# Altium schematic sheet Power Distribution - Camera.SchDoc: Title
size B; Organization: Midnight Sun Solar Rayce Car Team; Address1: University of Waterloo; Address2: 200 University Ave W; Address3: Waterloo, ON, Canada; Address4: N2L 3E9; Website: www.uwmidsun.com; ProjectName: ProjectName
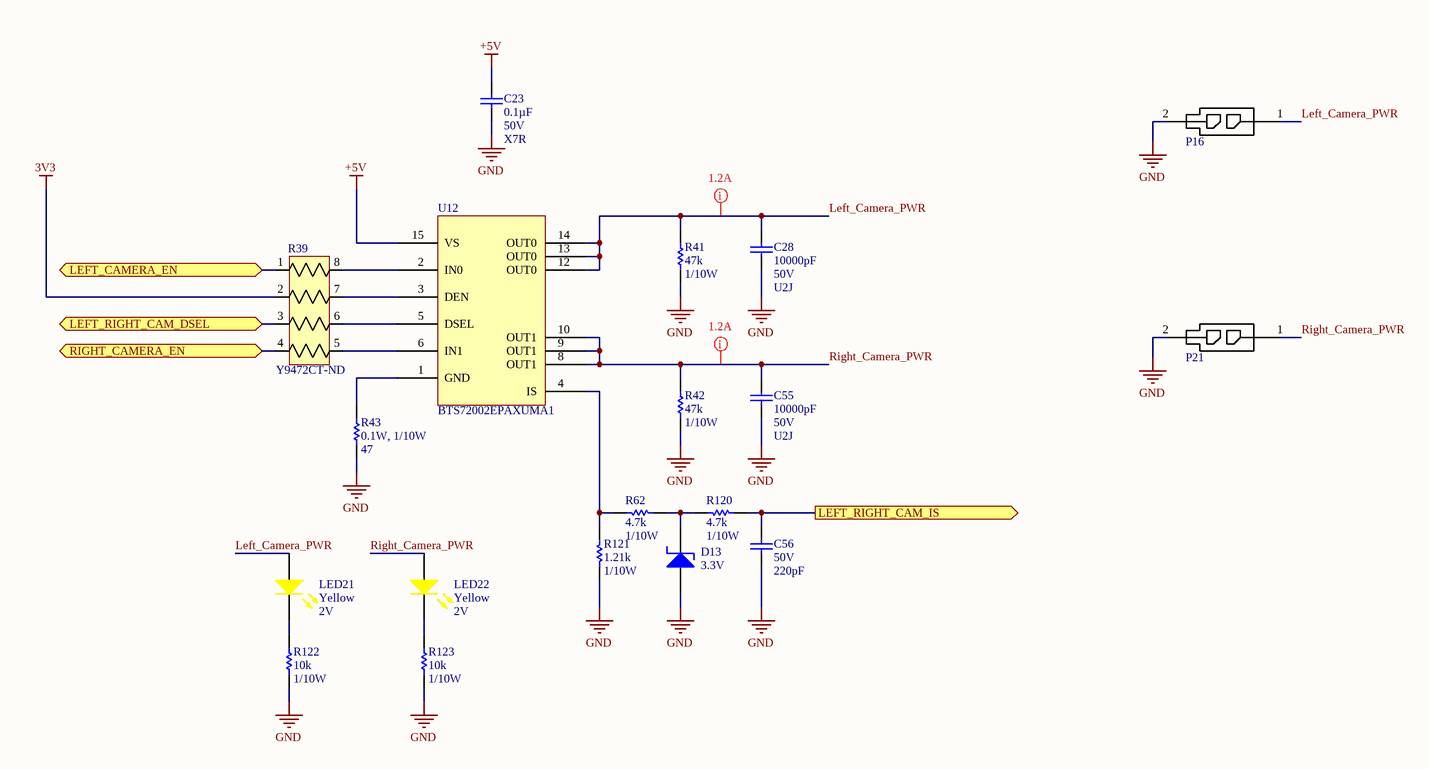
[diagram p0: Power Distribution - Camera.SchDoc]

## Parts
C23  Capacitance: 0.1µF  Voltage: 50V  Temperature Coefficient: X7R  [CAP, 0603]  (hidden comment: CAP CER 0.1UF 50V 10% X7R 0603)
C28  Capacitance: 10000pF  Voltage: 50V  Temperature Coefficient: U2J  [CAP, 0603]  (hidden comment: CAP CER 10nF 50V 5% X7R 0603)
C55  Capacitance: 10000pF  Voltage: 50V  Temperature Coefficient: U2J  [CAP, 0603]  (hidden comment: CAP CER 10nF 50V 5% X7R 0603)
C56  Voltage Rating: 50V  Capacitance: 220pF  [CAP, 0603]  (hidden comment: CAP CER 220PF 50V C0G/NP0 0603)
D13  Voltage: 3.3V  [sod-323]  (hidden comment: DIODE ZENER 3.3V 200MW SOD323)
LED21  Color: Yellow  Voltage - Forward (Vf) (Typ): 2V  [LED_0603]  (hidden comment: LED YELLOW CLEAR 2.1V 0603)
LED22  Color: Yellow  Voltage - Forward (Vf) (Typ): 2V  [LED_0603]  (hidden comment: LED YELLOW CLEAR 2.1V 0603)
P16  CONN 2POS MICRO-FIT 3mm  [CONN, 2POS MICRO-FIT]  (value not drawn)
P21  CONN 2POS MICRO-FIT 3mm  [CONN, 2POS MICRO-FIT]  (value not drawn)
R39  Supplier Part Number 1: Y9472CT-ND  [RES ARRAY 4RES 1206]  (hidden comment: RES ARRAY 4 RES 4.7K OHM 1206)
R41  Resistance: 47k  Power Rating: 1/10W  [RES, 0603]  (hidden comment: RES 47K OHM 1% 1/10W 0603)
R42  Resistance: 47k  Power Rating: 1/10W  [RES, 0603]  (hidden comment: RES 47K OHM 1% 1/10W 0603)
R43  Power (Watts): 0.1W, 1/10W  Values: 47  [RES, 0603]  (hidden comment: RES SMD 47 OHM 1% 1/10W 0603)
R62  Resistance (Ohms): 4.7k  Power (Watts): 1/10W  [RES, 0603]  (hidden comment: RES 4.7K OHM 1% 1/10W 0603)
R120  Resistance (Ohms): 4.7k  Power (Watts): 1/10W  [RES, 0603]  (hidden comment: RES 4.7K OHM 1% 1/10W 0603)
R121  Resistance: 1.21k  Power: 1/10W  [RES, 0603]  (hidden comment: RES 1.21K OHM 1% 1/10W 0603)
R122  Resistance: 10k  Power: 1/10W  [RES, 0603]  (hidden comment: RES 10K OHM 1% 1/10W 0603)
R123  Resistance: 10k  Power: 1/10W  [RES, 0603]  (hidden comment: RES 10K OHM 1% 1/10W 0603)
U12  Manufacturer Part Number: BTS72002EPAXUMA1  [IC LOAD SWITCH PG-TSDSO-14-22]  (hidden comment: IC LOAD SWITCH BTS7200-2EPA PG-TSDSO-14_1)

## Ports
LEFT_CAMERA_EN (bidir), LEFT_RIGHT_CAM_DSEL (bidir), LEFT_RIGHT_CAM_IS (out), RIGHT_CAMERA_EN (bidir)

## Nets
3V3: R39.2
+5V: C23.1 U12.15(VS)
GND: C23.2 C28.2 C55.2 C56.2 D13.1(A) P16.2 P21.2 R41.2 R42.2 R43.2 R121.2 R122.2 R123.2
LEFT_CAMERA_EN: R39.1 ; port LEFT_CAMERA_EN
Left_Camera_PWR: C28.1 LED21.1(A) P16.1 R41.1 U12.12(OUT0) U12.13(OUT0) U12.14(OUT0)
LEFT_RIGHT_CAM_DSEL: R39.3 ; port LEFT_RIGHT_CAM_DSEL
LEFT_RIGHT_CAM_IS: C56.1 R120.1 ; port LEFT_RIGHT_CAM_IS
RIGHT_CAMERA_EN: R39.4 ; port RIGHT_CAMERA_EN
Right_Camera_PWR: C55.1 LED22.1(A) P21.1 R42.1 U12.8(OUT1) U12.9(OUT1) U12.10(OUT1)
NetD13_2: D13.2(K) R62.1 R120.2
NetLED21_2: LED21.2(K) R122.1
NetLED22_2: LED22.2(K) R123.1
NetR39_5: R39.5 U12.6(IN1)
NetR39_6: R39.6 U12.5(DSEL)
NetR39_7: R39.7 U12.3(DEN)
NetR39_8: R39.8 U12.2(IN0)
NetR43_1: R43.1 U12.1(GND)
NetR62_2: R62.2 R121.1 U12.4(IS)

## Layout directives
mark named 1.2A: Left_Camera_PWR, Right_Camera_PWR

## Notes on the sheet
- PROJECT
- DOCUMENT
- DRAWN BY
- LAST MODIFIED
- PART NUMBER
- REVISION
- SHEET
- VARIANT
- OF
- Engineering 5 - 1002
  University of Waterloo
  (519) 888-4567 x32978
  hardware@uwmidsun.com

## Library data of the parts
C23 = CAP CER 0.1UF 50V 10% X7R 0603: 0.10µF ±10% 50V Ceramic Capacitor X7R 0603 (1608 Metric); Manufacturer 1: AVX Corporation; Manufacturer Part Number 1: 06035C104KAT2A; Supplier 1: Digi-Key; Supplier Part Number 1: 478-5052-1-ND; Packaging: Cut Tape (CT); Part Status: Active; Operating Temperature: -55°C ~ 125°C; Ratings: -; Mounting Type: Surface Mount, MLCC; Package / Case: 0603 (1608 Metric); Size / Dimension: 0.063" L x 0.032" W (1.60mm x 0.81mm); Height - Seated (Max): -; Thickness (Max): 0.035" (0.90mm); Lead Spacing: -; Lead Style: -; ComponentLink1URL: http://datasheets.avx.com/X7RDielectric.pdf; ComponentLink1Description: http://datasheets.avx.com/X7RDielectric.pdf; Tolerance: ±10%
C28 C55 = CAP CER 10nF 50V 5% X7R 0603: 10000pF ±5% 50V Ceramic Capacitor U2J 0603 (1608 Metric); Manufacturer 1: KEMET; Manufacturer Part Number 1: C0603C103J5JAC7867; Supplier 1: Digi-Key; Supplier Part Number 1: 399-13384-1-ND; Packaging: Cut Tape (CT); Part Status: Active; Operating Temperature: -55°C ~ 125°C; Ratings: -; Failure Rate: -; Mounting Type: Surface Mount, MLCC; Package / Case: 0603 (1608 Metric); Size / Dimension: 0.063" L x 0.032" W (1.60mm x 0.80mm); Height - Seated (Max): -; Thickness (Max): 0.034" (0.87mm); Lead Spacing: -; Lead Style: -; ComponentLink1URL: http://www.kemet.com/docfinder?Partnumber=C0603C103J5JAC7867; ComponentLink1Description: http://www.kemet.com/docfinder?Partnumber=C0603C103J5JAC7867; Tolerance: ±5%
C56 = CAP CER 220PF 50V C0G/NP0 0603: 220pF ±5% 50V Ceramic Capacitor C0G, NP0 0603 (1608 Metric); Manufacturer: KEMET; Manufacturer Part Number: C0603C221J5GACAUTO; Dissipation Factor: 0.1%; Supplier 1: Digi-Key; Supplier Part Number 1: 399-6868-1-ND; Stock 1: 35170; Pricing 1: 1=0.14000, 10=0.09700, 100=0.04550, 500=0.03188, 1000=0.02640 (USD); RoHS: Yes; Mount: Surface Mount; Case/Package: 0603; Case Code (Metric): 1608; Case Code (Imperial): 0603; Contact Plating: Tin; Dielectric Material: Ceramic; Min Operating Temperature: -55°C; Max Operating Temperature: 125°C; Tolerance: 5%; Packaging: Tape and Reel; Package Quantity: 1; Voltage Rating (DC): 50V; Termination: SMD/SMT; Length: 1.6mm; Height: 0.8mm; Width: 0.031inch; Thickness: 0.034inch; Depth: 0.8mm; Ratings: AEC-Q200; Radiation Hardening: No; REACH SVHC: No SVHC; Lead Free: Lead Free; ComponentLink1URL: https://datasheet.ciiva.com/18192/getdatasheetpartid-416741-18192869.pdf?src-supplier=Verical; ComponentLink1Description: https://datasheet.ciiva.com/18192/getdatasheetpartid-416741-18192869.pdf?src-supplier=Verical; ComponentLink2URL: https://datasheet.ciiva.com/22694/1633156-22694015.pdf?src-supplier=Element14; ComponentLink2Description: https://datasheet.ciiva.com/22694/1633156-22694015.pdf?src-supplier=Element14; Dielectric: C0G
D13 = DIODE ZENER 3.3V 200MW SOD323: Zener Diode 3.3V 200mW ±5% Surface Mount SOD-323; ComponentLink1Description: http://www.vishay.com/docs/85764/bzx384.pdf; ComponentLink1URL: http://www.vishay.com/docs/85764/bzx384.pdf; Supplier 1: Digi-Key; Supplier Part Number 1: BZX384C3V3-E3-08GICT-ND
LED21 LED22 = LED YELLOW CLEAR 2.1V 0603: Yellow 590nm LED Indication - Discrete 2V 0603 (1608 Metric); Manufacturer: Wurth Electronics Inc.; Manufacturer Part Number: 150060YS75000; Lens Color: Colorless; Millicandela Rating: 120mcd; Lens Style/Size: Rectangle with Flat Top, 1.10mm x 0.70mm; Current - Test: 20mA; Viewing Angle: 140°; Wavelength - Peak: 595nm; Supplier 1: Digi-Key; RoHS: RoHS Compliant; Category: Optoelectronics; Stock 1: 10523; Pricing 1: 1=0.21, 100=0.1617, 500=0.13964 (CAD); Packaging: Cut Tape (CT); Part Status: Active; Lens Transparency: Clear; Mounting Type: Surface Mount; Wavelength - Dominant: 590nm; Features: -; Package / Case: 0603 (1608 Metric); Supplier Device Package: 0603; Size / Dimension: 1.60mm L x 0.80mm W; Height (Max): 0.80mm; ComponentLink1URL: http://katalog.we-online.de/led/datasheet/150060YS75000.pdf; ComponentLink1Description: http://katalog.we-online.de/led/datasheet/150060YS75000.pdf; Supplier Part Number 1: 732-4981-1-ND
P16 P21 = CONN 2POS MICRO-FIT 3mm: Connector Header Through Hole 2 position; Manufacturer: Molex; Manufacturer Part Number: 43045-0227; Number of Positions: 2; Gender: Male; Contact Resistance: 10mR; Number of Ports: 1; Max Voltage Rating (DC): 250.25kV; Current Rating: 5A; Voltage Rating: 600V; Glow Wire Compliant: Compliant; Supplier 1: Digi-Key; Stock 1: 3657; Pricing 1: 1=0.84, 10=0.74, 25=0.6968, 50=0.6676, 100=0.6387, 250=0.5806, 500=0.52254, 1000=0.46448, 2500=0.42094 (USD); Mount: Through Hole; Contact Plating: Tin; Contact Material: Brass; Housing Colour: Black; Housing Material: Thermoplastic; Number of Terminals: 2; Min Operating Temperature: -40°C; Max Operating Temperature: 105°C; Number of Rows: 2; Packaging: Tray; Termination: Solder; Number of Contacts: 2; Orientation: Vertical; Package Quantity: 3168; Number of Circuits: 2; Length: 7.15mm; Pitch: 3mm; Depth: 8.77mm; Row Spacing: 3mm; Radiation Hardening: No; Halogen Free: Low Halogen; ComponentLink1URL: http://www.onlinecomponents.com/productFiles/mf-MOL/307170430450227_pcb_headers.pdf; ComponentLink1Description: http://www.onlinecomponents.com/productFiles/mf-MOL/307170430450227_pcb_headers.pdf; ComponentLink2URL: http://www.mouser.com/ds/2/276/0430450227_PCB_HEADERS-142611.pdf; ComponentLink2Description: http://www.mouser.com/ds/2/276/0430450227_PCB_HEADERS-142611.pdf; ComponentLink3URL: http://uk.rs-online.com/webdocs/13c3/0900766b813c3a46.pdf; ComponentLink3Description: http://uk.rs-online.com/webdocs/13c3/0900766b813c3a46.pdf; ComponentLink4URL: http://www.molex.com/webdocs/datasheets/pdf/en-us/0430450227_PCB_HEADERS.pdf; ComponentLink4Description: http://www.molex.com/webdocs/datasheets/pdf/en-us/0430450227_PCB_HEADERS.pdf; Supplier Part Number 1: WM10657-ND
R39 = RES ARRAY 4 RES 4.7K OHM 1206: 4.7k Ohm ±5% 62.5mW Power Per Element Isolated 4 Resistor Network/Array ±200ppm/°C 1206 (3216 Metric), Convex, Long Side Terminals; Number of Resistors: 4; Applications Automotive: AEC-Q200; Applications: -; Category: Resistors; Circuit Type: Isolated; Part Status: Active; Resistance (Ohms): 4.7k; Tolerance: ±5%; Power Per Element: 62.5mW; Number of Pins: 8; Operating Temperature: -55°C ~ 125°C; Mounting Type: Surface Mount; Package / Case: 1206 (3216 Metric), Convex, Long Side Terminals; Supplier Device Package: 1206; Size / Dimension: 0.126" L x 0.063" W (3.20mm x 1.60mm); Height - Seated (Max): 0.024" (0.60mm); Packaging: Cut Tape (CT); Resistor Matching Ratio: -; Resistor-Ratio-Drift: -; Series: EXB; ComponentLink1Description: https://industrial.panasonic.com/cdbs/www-data/pdf/AOC0000/AOC0000C14.pdf; ComponentLink1URL: https://industrial.panasonic.com/cdbs/www-data/pdf/AOC0000/AOC0000C14.pdf; Supplier 1: Digi-Key; Temperature Coefficient: ±200ppm/°C
R41 R42 = RES 47K OHM 1% 1/10W 0603: 47 kOhms ±1% 0.1W, 1/10W Chip Resistor 0603 (1608 Metric) Automotive AEC-Q200 Thick Film; Manufacturer: Panasonic; Manufacturer Part Number: ERJ3EKF4702V; Voltage Rating: 75V; Temperature Coefficient: 100ppm/°C; Working Voltage: 6V; Max Power Dissipation: 100mW; ComponentLink1URL: https://industrial.panasonic.com/cdbs/www-data/pdf/RDO0000/AOA0000C291.pdf; ComponentLink1Description: https://industrial.panasonic.com/cdbs/www-data/pdf/RDO0000/AOA0000C291.pdf; ComponentLink2URL: https://datasheet.ciiva.com/6138/aoa0000ce2-6138149.pdf?src-supplier=Farnell; ComponentLink2Description: https://datasheet.ciiva.com/6138/aoa0000ce2-6138149.pdf?src-supplier=Farnell; ComponentLink3URL: https://datasheet.ciiva.com/7802/aoa0000ce2-7802421.pdf?src-supplier=Element14; ComponentLink3Description: https://datasheet.ciiva.com/7802/aoa0000ce2-7802421.pdf?src-supplier=Element14; ComponentLink4URL: https://datasheet.ciiva.com/48531/aoa0000ce2-48531029.pdf?src-supplier=Avnet; ComponentLink4Description: https://datasheet.ciiva.com/48531/aoa0000ce2-48531029.pdf?src-supplier=Avnet; ComponentLink5URL: https://datasheet.ciiva.com/16514/aoa0000ce2-16514071.pdf?src-supplier=Avnet+Asia; ComponentLink5Description: https://datasheet.ciiva.com/16514/aoa0000ce2-16514071.pdf?src-supplier=Avnet+Asia; ComponentLink6URL: https://datasheet.ciiva.com/46398/1678782-46398088.pdf?src-supplier=Element14; ComponentLink6Description: https://datasheet.ciiva.com/46398/1678782-46398088.pdf?src-supplier=Element14; ComponentLink7URL: https://datasheet.ciiva.com/24069/aoa0000ce2-24069209.pdf?src-supplier=Mouser; ComponentLink7Description: https://datasheet.ciiva.com/24069/aoa0000ce2-24069209.pdf?src-supplier=Mouser; ComponentLink8URL: https://datasheet.ciiva.com/46398/1678782-46398089.pdf?src-supplier=Element14; ComponentLink8Description: https://datasheet.ciiva.com/46398/1678782-46398089.pdf?src-supplier=Element14; ComponentLink9URL: https://datasheet.ciiva.com/30236/aoa0000ce2-30236698.pdf?src-supplier=Onlinecomponents.com; ComponentLink9Description: https://datasheet.ciiva.com/30236/aoa0000ce2-30236698.pdf?src-supplier=Onlinecomponents.com; ComponentLink10URL: https://datasheet.ciiva.com/22722/426256-22722781.pdf?src-supplier=Element14; ComponentLink10Description: https://datasheet.ciiva.com/22722/426256-22722781.pdf?src-supplier=Element14; ComponentLink11URL: https://datasheet.ciiva.com/16758/70260748-16758831.pdf?src-supplier=Allied+Electronics; ComponentLink11Description: https://datasheet.ciiva.com/16758/70260748-16758831.pdf?src-supplier=Allied+Electronics; Supplier 1: Digi-Key; Stock 1: 1704740; Pricing 1: 1 = 0.100000, 10 = 0.065000, 100 = 0.026400, 1000 = 0.011860, 2500 = 0.010290 (USD); RoHS: Yes; Mount: Surface Mount; Case/Package: 0603; Number of Pins: 2; Case Code (Metric): 1608; Case Code (Imperial): 0603; Contact Plating: Tin; Min Operating Temperature: -55°C; Max Operating Temperature: 155°C; Tolerance: 1%; Packaging: Tape and Reel; Package Quantity: 1; Composition: Thick Film; Number of Terminations: 2; Termination: SMD/SMT; Military Standard: Not; Voltage Rating (DC): 75V; Features: Automotive AEC-Q200; Length: 1.6mm; Height: 0.022inch; Width: 0.031inch; Depth: 0.8mm; Radiation Hardening: No; REACH SVHC: No SVHC; Lead Free: Lead Free; Supplier Part Number 1: P47.0KHCT-ND
R43 = RES SMD 47 OHM 1% 1/10W 0603: 47 Ohms ±1% 0.1W, 1/10W Chip Resistor 0603 (1608 Metric) Automotive AEC-Q200, Moisture Resistant Thick Film; Temperature Coefficient: ±100ppm/°C; Resistance: 47 Ohms; Operating Temperature: -55°C ~ 155°C; Features: Automotive AEC-Q200, Moisture Resistant; Tolerance: ±1%; Composition: Thick Film; Ratings: AEC-Q200; Package / Case: 0603 (1608 Metric); Number of Terminations: 2; Height - Seated (Max): 0.022" (0.55mm); Size / Dimension: 0.063" L x 0.031" W (1.60mm x 0.80mm); ComponentLink1Description: https://www.yageo.com/upload/media/product/productsearch/datasheet/rchip/PYu-AC_51_RoHS_L_7.pdf; ComponentLink1URL: https://www.yageo.com/upload/media/product/productsearch/datasheet/rchip/PYu-AC_51_RoHS_L_7.pdf; Supplier 1: Digi-Key; Supplier Part Number 1: 311-47LDCT-ND; Supplier Device Package: 0603
R62 R120 = RES 4.7K OHM 1% 1/10W 0603: 4.7k Ohm ±1% 0.1W, 1/10W Chip Resistor 0603 (1608 Metric) Moisture Resistant Thick Film; Manufacturer 1: Yageo; Manufacturer Part Number 1: RC0603FR-074K7L; Description 1: RES SMD 4.7K OHM 1% 1/10W 0603; Temperature Coefficient: ±100ppm/°C; Supplier 1: Digi-Key; Supplier Part Number 1: 311-4.70KHRCT-ND; RoHS: RoHS Compliant; Category: Resistors; Stock 1: 3487566; Pricing 1: 1=0.16, 10=0.022, 100=0.0089, 1000=0.00402, 2500=0.00349 (CAD); Packaging: Cut Tape (CT); Part Status: Active; Composition: Thick Film; Features: Moisture Resistant; Operating Temperature: -55°C ~ 155°C; Package / Case: 0603 (1608 Metric); Supplier Device Package: 0603; Size / Dimension: 0.063" L x 0.031" W (1.60mm x 0.80mm); Height - Seated (Max): 0.022" (0.55mm); Failure Rate: -; ComponentLink1URL: http://www.yageo.com/documents/recent/PYu-RC_Group_51_RoHS_L_7.pdf; ComponentLink1Description: http://www.yageo.com/documents/recent/PYu-RC_Group_51_RoHS_L_7.pdf; Tolerance: ±1%
R121 = RES 1.21K OHM 1% 1/10W 0603: 1.21k Ohm ±1% 0.1W, 1/10W Chip Resistor 0603 (1608 Metric) Moisture Resistant Thick Film; Manufacturer 1: Yageo; Manufacturer Part Number 1: RC0603FR-071K21L; Temperature Coefficient: ±100ppm/°C; Supplier 1: Digi-Key; Supplier Part Number 1: 311-1.21KHRCT-ND; Packaging: Cut Tape (CT); Part Status: Active; Composition: Thick Film; Operating Temperature: -55°C ~ 155°C; Package / Case: 0603 (1608 Metric); Supplier Device Package: 0603; Size / Dimension: 0.063" L x 0.031" W (1.60mm x 0.80mm); Height - Seated (Max): 0.022" (0.55mm); Failure Rate: -; ComponentLink1URL: http://www.yageo.com/documents/recent/PYu-RC_Group_51_RoHS_L_7.pdf; ComponentLink1Description: http://www.yageo.com/documents/recent/PYu-RC_Group_51_RoHS_L_7.pdf; Tolerance: ±1%
R122 R123 = RES 10K OHM 1% 1/10W 0603: RES SMD 10K OHM 1% 1/10W 0603; Manufacturer 1: Yageo; Manufacturer Part Number 1: RC0603FR-0710KL; Temperature Coefficient: ±100ppm/°C; Supplier 1: Digi-Key; Supplier Part Number 1: 311-10.0KHRCT-ND; Packaging: Cut Tape (CT); Part Status: Active; Composition: Thick Film; Operating Temperature: -55°C ~ 155°C; Package / Case: 0603 (1608 Metric); Supplier Device Package: 0603; Size / Dimension: 0.063" L x 0.031" W (1.60mm x 0.80mm); Height - Seated (Max): 0.022" (0.55mm); Failure Rate: -; ComponentLink1URL: http://www.yageo.com/documents/recent/PYu-RC_Group_51_RoHS_L_7.pdf; ComponentLink1Description: http://www.yageo.com/documents/recent/PYu-RC_Group_51_RoHS_L_7.pdf; Tolerance: ±1%
U12 = IC LOAD SWITCH BTS7200-2EPA PG-TSDSO-14_1: Power Switch/Driver 1:1 N-Channel 1.2A PG-TSDSO-14-22; Manufacturer: Infineon; Supplier 1: Digi-Key; Supplier Part Number 1: BTS72002EPAXUMA1CT-ND; Stock 1: 1973; Pricing 1: 1=1.31000, 10=1.17500, 100=0.91640, 500=0.75700, 1000=0.59763 (USD); RoHS: No; ComponentLink1Description: https://www.infineon.com/dgdl/Infineon-BTS7200-2EPA-DS-v01_00-EN.pdf?fileId=5546d462636cc8fb016421e548a61215; ComponentLink1URL: https://www.infineon.com/dgdl/Infineon-BTS7200-2EPA-DS-v01_00-EN.pdf?fileId=5546d462636cc8fb016421e548a61215